# Altium schematic sheet Power_Supply.SchDoc
size A
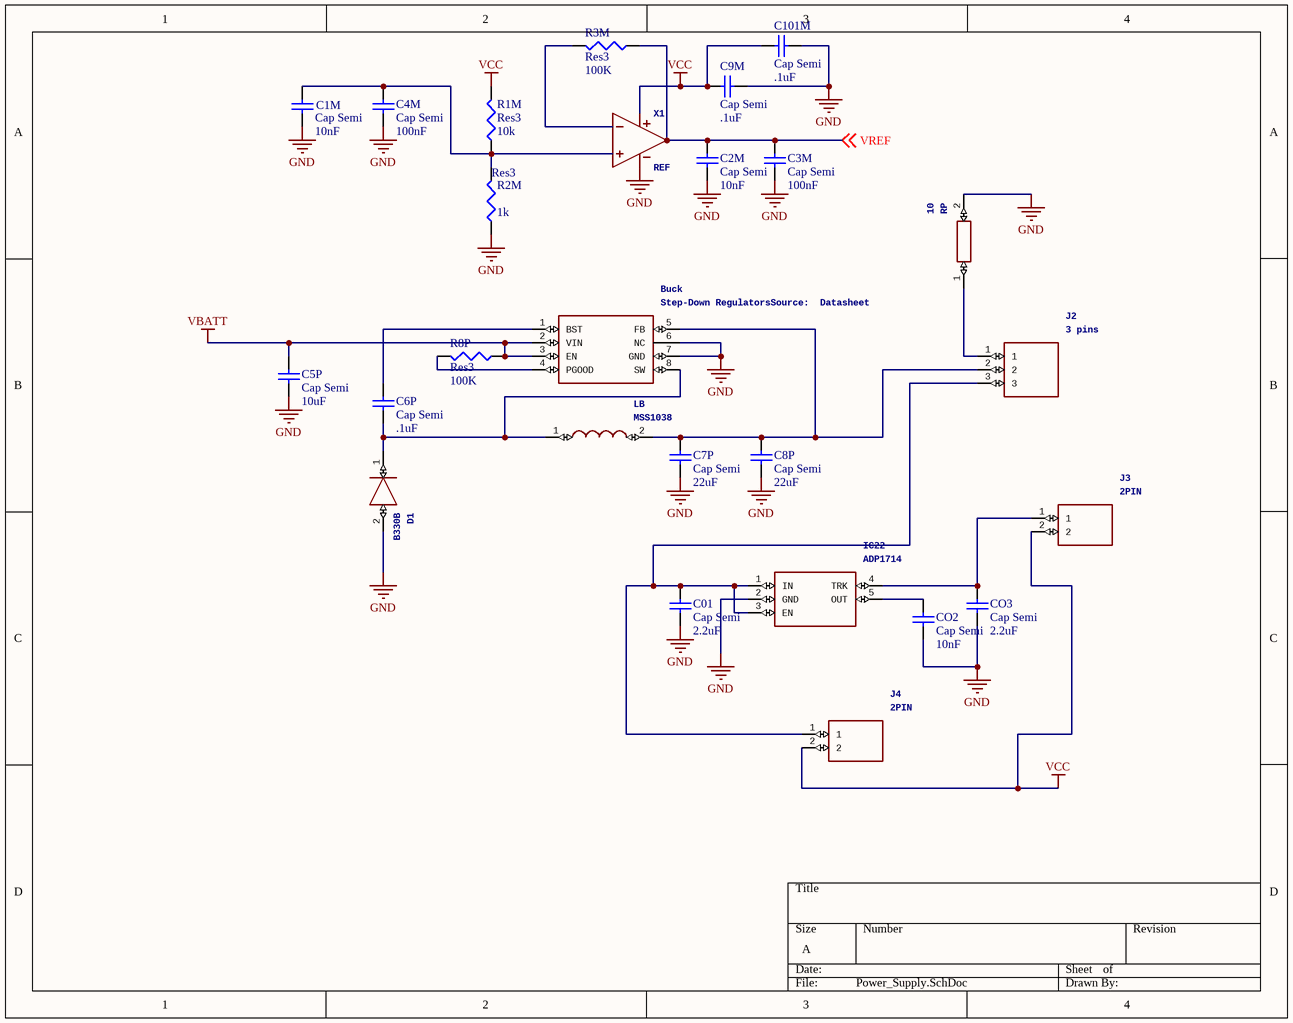
[diagram p0: Power_Supply.SchDoc]

## Parts
10  RP  [RESAD3800W75L1600D550]
Buck  Step-Down RegulatorsSource:  Datasheet  [SOIC127P600X175-9N]
C01  Cap Semi  value 2.2uF  [1608[0603]]
C1M  Cap Semi  value 10nF  [CAPPM6032X280N]
C2M  Cap Semi  value 10nF  [CAPPM6032X280N]
C3M  Cap Semi  value 100nF  [1608[0603]]
C4M  Cap Semi  value 100nF  [1608[0603]]
C5P  Cap Semi  value 10uF  [1608[0603]]
C6P  Cap Semi  value .1uF  [1608[0603]]
C7P  Cap Semi  value 22uF  [1608[0603]]
C8P  Cap Semi  value 22uF  [1608[0603]]
C9M  Cap Semi  value .1uF  [1608[0603]]
C101M  Cap Semi  value .1uF  [CAPPM6032X280N]
CO2  Cap Semi  value 10nF  [1608[0603]]
CO3  Cap Semi  value 2.2uF  [1608[0603]]
D1  B330B  [DIOM5336X250N]
IC22  ADP1714  [SOT95P280X100-5N]
J2  3 pins  [HDRV3W95P0X254_1X3_762X254X869]
J3  2PIN  [HDRV2W110P0X254_1X2_508X254X85]
J4  2PIN  [HDRV2W110P0X254_1X2_508X254X85]
LB  MSS1038  [INDM102102X400N]
R1M  Res3  value 10k  [1608[0603]]
R2M  Res3  value 1k  [1608[0603]]
R3M  Res3  value 100K  [1608[0603]]
R8P  Res3  value 100K  [1608[0603]]
X1  REF  [SOT95P290X145-5N]

## Nets
GND: 10.2 Buck.6(NC) Buck.7(GND) C01.1 C1M.1 C2M.1 C3M.1 C4M.1 C5P.1 C7P.1 C8P.1 C9M.1 C101M.1 CO2.1 CO3.1 D1.2(A) IC22.2(GND) R2M.2 X1.2(V-)
VBATT: Buck.2(VIN) Buck.3(EN) C5P.2 R8P.2
VCC: C9M.2 C101M.2 J3.2 J4.2 R1M.1 X1.5(V+)
VREF: C2M.2 C3M.2 R3M.2 X1.1(OUT) ; off-sheet VREF
Net10_1: 10.1 J2.1
NetBuck_1: Buck.1(BST) C6P.2
NetBuck_4: Buck.4(PGOOD) R8P.1
NetBuck_5: Buck.5(FB) C7P.2 C8P.2 J2.2 LB.2
NetBuck_8: Buck.8(SW) C6P.1 D1.1(K) LB.1
NetC01_2: C01.2 IC22.1(IN) IC22.3(EN) J2.3 J4.1
NetC1M_2: C1M.2 C4M.2 R1M.2 R2M.1 X1.3(IN+)
NetCO2_2: CO2.2 IC22.5(OUT)
NetCO3_2: CO3.2 IC22.4(TRK) J3.1
NetR3M_1: R3M.1 X1.4(IN-)

## Library data of the parts
10 = ROX3SJ220R: Manufacturer_Name: TE Connectivity; GateName_1: G$1; Allied_Number: 70063816; SymbolName_1: ROX3SJ220R; LibraryName: ROX3SJ220R; DeviceSetName: ROX3SJ220R; Package: RESAD3800W75L1600D550; Manufacturer_Part_Number: ROX3SJ220R; RS_Part_Number: 1615998; RS_Price-Stock: http://uk.rs-online.com/web/p/products/1615998; Allied_Price-Stock: https://www.alliedelec.com/te-connectivity-rox3sj220r/70063816/; Arrow_Part_Number: ROX3SJ220R; Arrow_Price-Stock: https://www.arrow.com/en/products/rox3sj220r/te-connectivity; Height: mm
Buck = ADP2302ARDZ-5.0-R7: Manufacturer_Name: Analog Devices; GateName_1: G$1; SymbolName_1: ADP2302ARDZ-5.0-R7; LibraryName: ADP2302ARDZ-5.0-R7; DeviceSetName: ADP2302ARDZ-5.0-R7; Package: SOIC127P600X175-9N; Manufacturer_Part_Number: ADP2302ARDZ-5.0-R7; RS_Part_Number: 7591815P; RS_Price-Stock: http://uk.rs-online.com/web/p/products/7591815P; Arrow_Part_Number: ADP2302ARDZ-5.0-R7; Arrow_Price-Stock: https://www.arrow.com/en/products/adp2302ardz-5.0-r7/analog-devices; Height: mm
C01 C1M C2M C3M C4M C5P C6P C7P C8P C9M C101M CO2 CO3 = Cap Semi: Capacitor (Semiconductor SIM Model); Published: 8-Jun-2000; LatestRevisionDate: 29-May-2009; LatestRevisionNote: IPC-7351 Footprint Added.; PackageReference: C1206; Publisher: Altium Limited; PackageDescription: Chip Capacitor
D1 = B330B-13-F: Manufacturer_Name: Diodes Inc.; GateName_1: G$1; SymbolName_1: B330B-13-F; LibraryName: B330B-13-F; DeviceSetName: B330B-13-F; Package: DIOM5336X250N; Manufacturer_Part_Number: B330B-13-F; RS_Part_Number: 9228339; RS_Price-Stock: http://uk.rs-online.com/web/p/products/9228339; Arrow_Part_Number: B330B-13-F; Arrow_Price-Stock: https://www.arrow.com/en/products/b330b-13-f/diodes-incorporated; Height: 2.5mm
IC22 = ADP1714AUJZ-3.3-R7: Manufacturer_Name: Analog Devices; GateName_1: G$1; SymbolName_1: ADP1714AUJZ-3.3-R7; LibraryName: ADP1714AUJZ-3.3-R7; DeviceSetName: ADP1714AUJZ-3.3-R7; Package: SOT95P280X100-5N; Manufacturer_Part_Number: ADP1714AUJZ-3.3-R7; Arrow_Part_Number: ADP1714AUJZ-3.3-R7; Height: mm
J2 = 61300311121: Manufacturer_Name: Wurth Elektronik; GateName_1: G$1; SymbolName_1: 61300311121; LibraryName: 61300311121; DeviceSetName: 61300311121; Package: HDRV3W95P0X254_1X3_762X254X869; Manufacturer_Part_Number: 61300311121; RS_Part_Number: 1725145; RS_Price-Stock: http://uk.rs-online.com/web/p/products/1725145; Arrow_Part_Number: 61300311121; Arrow_Price-Stock: http://uk.rs-online.com/web/p/products/1725145; Height: 8.69mm
J3 J4 = 61300211121: Manufacturer_Name: Wurth Elektronik; GateName_1: G$1; SymbolName_1: 61300211121; LibraryName: 61300211121; DeviceSetName: 61300211121; Package: HDRV2W110P0X254_1X2_508X254X85; Manufacturer_Part_Number: 61300211121; RS_Part_Number: 8281581P; RS_Price-Stock: http://uk.rs-online.com/web/p/products/8281581P; Arrow_Part_Number: 61300211121; Arrow_Price-Stock: http://uk.rs-online.com/web/p/products/8281581P; Height: 8.54mm
LB = MSS1038-183MLB: Manufacturer_Name: COILCRAFT; GateName_1: G$1; SymbolName_1: MSS1038-183MLB; LibraryName: MSS1038-183MLB; DeviceSetName: MSS1038-183MLB; Package: INDM102102X400N; Manufacturer_Part_Number: MSS1038-183MLB; Arrow_Part_Number: MSS1038-183MLB; Height: 4mm
R1M R2M R3M R8P = Res3: Resistor; Published: 8-Jun-2000; LatestRevisionDate: 29-May-2009; LatestRevisionNote: IPC-7351 Footprint Added.; PackageReference: J1-0603; Publisher: Altium Limited; PackageDescription: Chip Resistor
X1 = OPAMP2: GateName_1: G$1; SymbolName_1: OPAMP2; LibraryName: Opamps; DeviceSetName: OPAMP2; Package: S8